# Altium schematic sheet CH341A1_CH341A.schdoc
size 127 x 99 mm
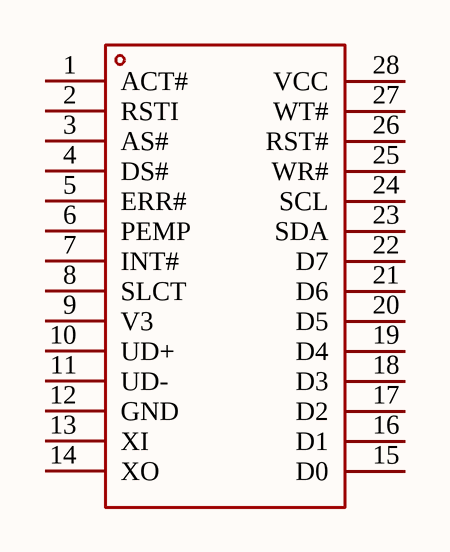
[diagram p0: CH341A1_CH341A.schdoc]

## Parts
U?  CH341A  [SOIC-28_L17.9-W7.5-P1.27-LS10.3-BL]  (value not drawn)

## Nets

Not connected (* = marked no-connect by the designer): U? 1(ACT#) 2(RSTI) 3(AS#) 4(DS#) 5(ERR#) 6(PEMP) 7(INT#) 8(SLCT) 9(V3) 10(UD+) 11(UD-) 12(GND) 13(XI) 14(XO) 15(D0) 16(D1) 17(D2) 18(D3) 19(D4) 20(D5) 21(D6) 22(D7) 23(SDA) 24(SCL) 25(WR#) 26(RST#) 27(WT#) 28(VCC)

## Library data of the parts
U? = CH341A: Manufacturer: WCH(南京沁恒); Add into BOM: yes; Applications Function: Transceiver; Supply Voltage: 3.3V；5V; Data Rate: 2Mbps; Symbol: CH341A; Device: CH341A; LCSC Part Name: CH341A; Supplier Part: C13517; Manufacturer Part: CH341A; Supplier Footprint: SOP-28-300mil; JLCPCB Part Class: Extended Part; Datasheet: https://atta.szlcsc.com/upload/public/pdf/source/20240313/41B70025278BA1C8A7FE817AD358F412.pdf; Supplier: LCSC; Convert to PCB: yes